# Altium project bottom_plate.PrjPcb
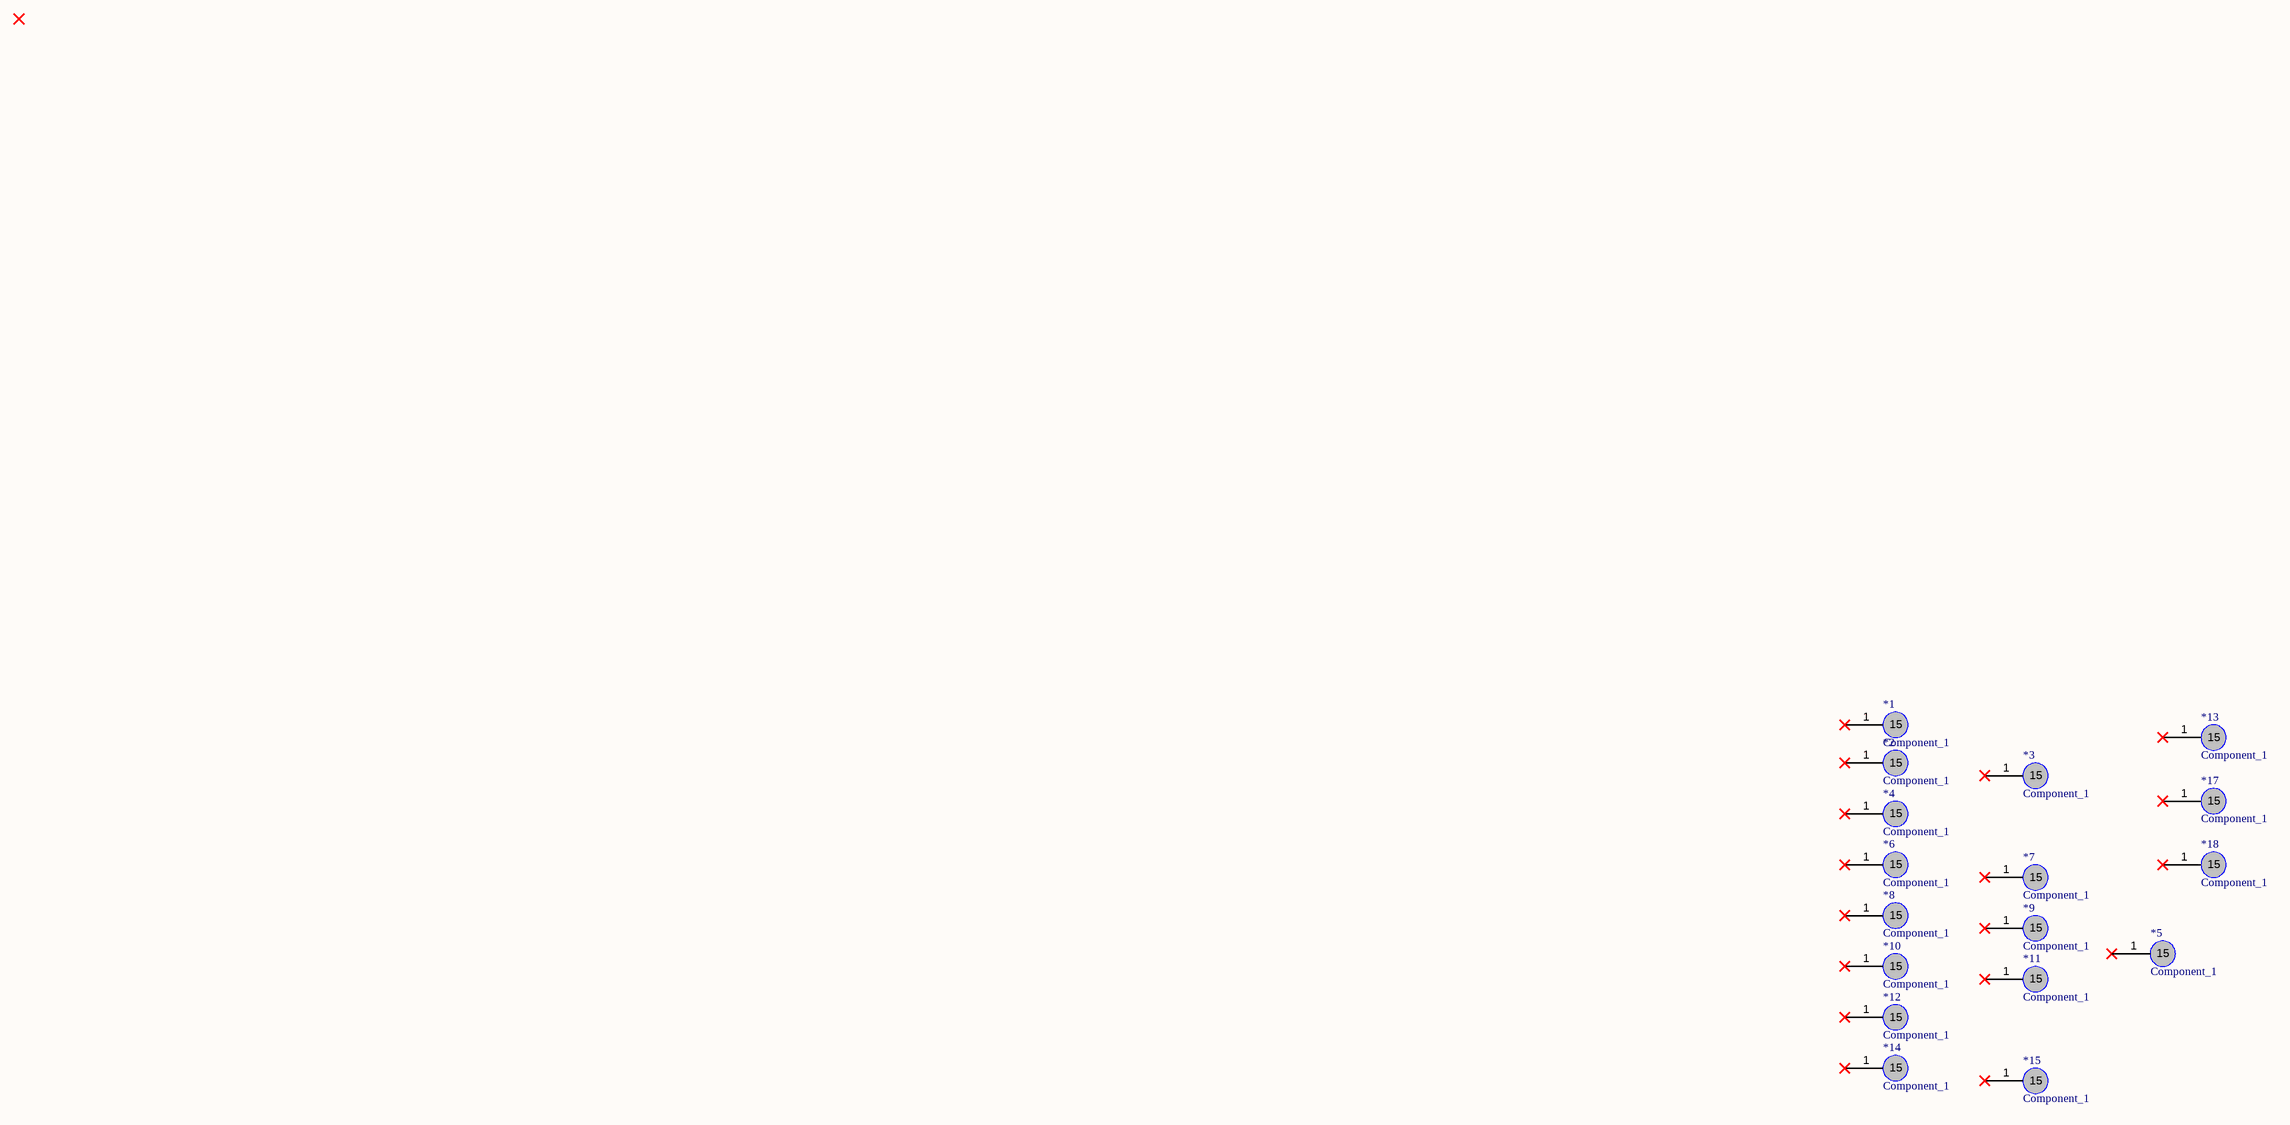
[diagram p0: bottom_plate.SchDoc]
1 sheet, 17 parts. Net scope: global (net labels, ports and power ports of the same name join across sheets).
Board file: bottom_plate.PcbDoc

## Sheet bottom_plate.SchDoc
size 558 x 431 mm

### Parts
*1  Component_1  [M2_Mounting_hole]
*2  Component_1  [M2_Mounting_hole]
*3  Component_1  [M2_Mounting_hole]
*4  Component_1  [M2_Mounting_hole]
*5  Component_1  [M2_Mounting_hole]
*6  Component_1  [M2_Mounting_hole]
*7  Component_1  [M2_Mounting_hole]
*8  Component_1  [M2_Mounting_hole]
*9  Component_1  [M2_Mounting_hole]
*10  Component_1  [M2_Mounting_hole]
*11  Component_1  [M2_Mounting_hole]
*12  Component_1  [M2_Mounting_hole]
*13  Component_1  [M2_Mounting_hole]
*14  Component_1  [M2_Mounting_hole]
*15  Component_1  [M2_Mounting_hole]
*17  Component_1  [M2_Mounting_hole]
*18  Component_1  [M2_Mounting_hole]

### Nets

Not connected (* = marked no-connect by the designer): *1 1(15)*; *2 1(15)*; *3 1(15)*; *4 1(15)*; *5 1(15)*; *6 1(15)*; *7 1(15)*; *8 1(15)*; *9 1(15)*; *10 1(15)*; *11 1(15)*; *12 1(15)*; *13 1(15)*; *14 1(15)*; *15 1(15)*; *17 1(15)*; *18 1(15)*

### Notes on the sheet
- DWG. NO.
- REV.
- SHT.
- REVISION
- DESCRIPTION
- DATE
- APPROVED
- THIS DOCUMENT AND THE DATA DISCLOSED HEREIN OR HEREWITH IS THE PROPERTY OF ALTIUM LIMITED AND MAY BE FREELY DISTRIBUTED IN WHOLE. NO RIGHTS ARE RESERVED OR EXPRESS OR IMPLIED WARANTEE GIVEN.
- ENG:
- DSN:
- APPROVALS
- PROJECT
- DOCUMENT REVISION:
- DESIGN ITEM:
- CHK:
- BOM:
- REFERENCE DOCUMENTS
- PROJECT REVISION:
- TITLE
- FAB DWG:
- PCB DWG:
- ASSY DWG:
- SCALE:
- SIZE
- C
- CAGE CODE
- FILE NAME
- DWG NO.
- SHEET
- OF
- REV